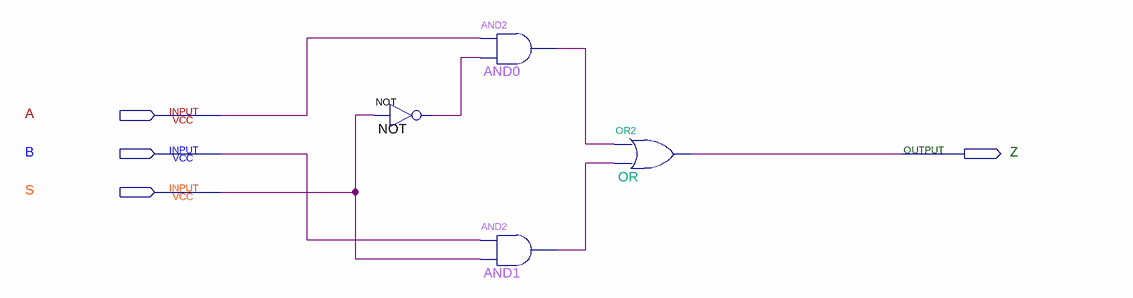
[diagram p0: schematic sheet]
// Quartus schematic MUX_2_1_1b.bdf as structural Verilog: 4 symbols, 4 pins
module MUX_2_1_1b (
  input  A,
  input  B,
  input  S,
  output Z
);

  wire AND0_out, AND1_out, NOT_out;

  not NOT (NOT_out, S);
  and AND0 (AND0_out, A, NOT_out);
  and AND1 (AND1_out, B, S);
  or OR (Z, AND0_out, AND1_out);
endmodule
